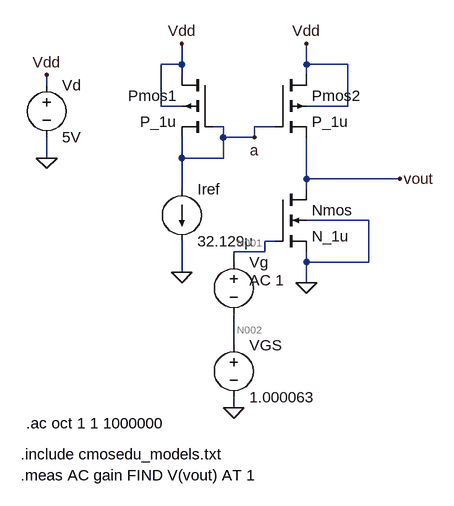
[diagram p0: schematic ex5.asc]
ex5.asc, the LTspice schematic file:
Version 4
SHEET 1 880 680
WIRE -1968 -1008 -1968 -1040
WIRE -1968 -1008 -2000 -1008
WIRE -1776 -1008 -1776 -1040
WIRE -1712 -1008 -1776 -1008
WIRE -1968 -992 -1968 -1008
WIRE -1776 -992 -1776 -1008
WIRE -2176 -976 -2176 -992
WIRE -2000 -944 -2000 -1008
WIRE -1968 -944 -2000 -944
WIRE -1712 -944 -1712 -1008
WIRE -1712 -944 -1776 -944
WIRE -1904 -912 -1920 -912
WIRE -1824 -912 -1856 -912
WIRE -1904 -896 -1904 -912
WIRE -1856 -896 -1856 -912
WIRE -1856 -896 -1904 -896
WIRE -2176 -864 -2176 -896
WIRE -1968 -864 -1968 -896
WIRE -1904 -864 -1904 -896
WIRE -1904 -864 -1968 -864
WIRE -1776 -832 -1776 -896
WIRE -1632 -832 -1776 -832
WIRE -1968 -816 -1968 -864
WIRE -1776 -816 -1776 -832
WIRE -1680 -768 -1776 -768
WIRE -1824 -736 -1840 -736
WIRE -1840 -720 -1840 -736
WIRE -1840 -720 -1888 -720
WIRE -1888 -704 -1888 -720
WIRE -1776 -704 -1776 -720
WIRE -1680 -704 -1680 -768
WIRE -1680 -704 -1776 -704
WIRE -1968 -688 -1968 -736
WIRE -1776 -672 -1776 -704
WIRE -1888 -576 -1888 -624
WIRE -1888 -480 -1888 -496
FLAG -2176 -864 0
FLAG -2176 -992 Vdd
FLAG -1968 -1040 Vdd
FLAG -1776 -1040 Vdd
FLAG -1968 -688 0
FLAG -1776 -672 0
FLAG -1632 -832 vout
FLAG -1888 -480 0
FLAG -1856 -896 a
SYMBOL voltage -2176 -992 R0
SYMATTR InstName Vd
SYMATTR Value 5V
SYMBOL pmos4 -1920 -992 M0
SYMATTR InstName Pmos1
SYMATTR Value P_1u
SYMATTR Value2 l=19.99564u w=3.00000u
SYMBOL pmos4 -1824 -992 R0
SYMATTR InstName Pmos2
SYMATTR Value P_1u
SYMATTR Value2 l=19.995640u w=3u
SYMBOL current -1968 -816 R0
WINDOW 123 0 0 Left 2
WINDOW 39 0 0 Left 2
SYMATTR InstName Iref
SYMATTR Value 32.129µ
SYMBOL nmos4 -1824 -816 R0
SYMATTR InstName Nmos
SYMATTR Value N_1u
SYMATTR Value2 l=1.500000u w=17.501335u
SYMBOL voltage -1888 -592 R0
WINDOW 123 0 0 Left 2
WINDOW 39 0 0 Left 2
SYMATTR InstName VGS
SYMATTR Value 1.000063
SYMBOL voltage -1888 -720 R0
WINDOW 123 24 44 Left 2
WINDOW 39 0 0 Left 2
SYMATTR Value2 AC 1
SYMATTR InstName Vg
SYMATTR Value ""
TEXT -2208 -456 Left 2 !.ac oct 1 1 1000000
TEXT -2216 -408 Left 2 !.include cmosedu_models.txt
TEXT -2216 -376 Left 2 !.meas AC gain FIND V(vout) AT 1

The netlist it stands for:
* ex5.asc
Vd Vdd 0 5V
M§Pmos1 Vdd a a Vdd P_1u l=19.99564u w=3.00000u
M§Pmos2 Vdd a vout Vdd P_1u l=19.995640u w=3u
Iref a 0 32.129µ
M§Nmos vout N001 0 0 N_1u l=1.500000u w=17.501335u
VGS N002 0 1.000063
Vg N001 N002 AC 1
.model NMOS NMOS
.model PMOS PMOS
.lib standard.mos
.ac oct 1 1 1000000
.include cmosedu_models.txt
.meas AC gain FIND V(vout) AT 1
.backanno
.end

* Results of the author's LTspice run, read from the files saved beside the schematic
* Operating Point, zero values left out:
*   V(vdd) = 5 V
*   V(a) = -272.3 mV
*   V(vout) = 1.419 V
*   V(n001) = 1 V
*   V(n002) = 1 V
*   Id(Nmos) = 32.08 µA
*   Ib(Nmos) = -1.429 pA
*   Is(Nmos) = -32.08 µA
*   Id(Pmos2) = 32.08 µA
*   Ib(Pmos2) = 3.591 pA
*   Is(Pmos2) = -32.08 µA
*   Id(Pmos1) = 32.13 µA
*   Ib(Pmos1) = 5.282 pA
*   Is(Pmos1) = -32.13 µA
*   I(Iref) = 32.13 µA
*   I(Vd) = -64.2 µA
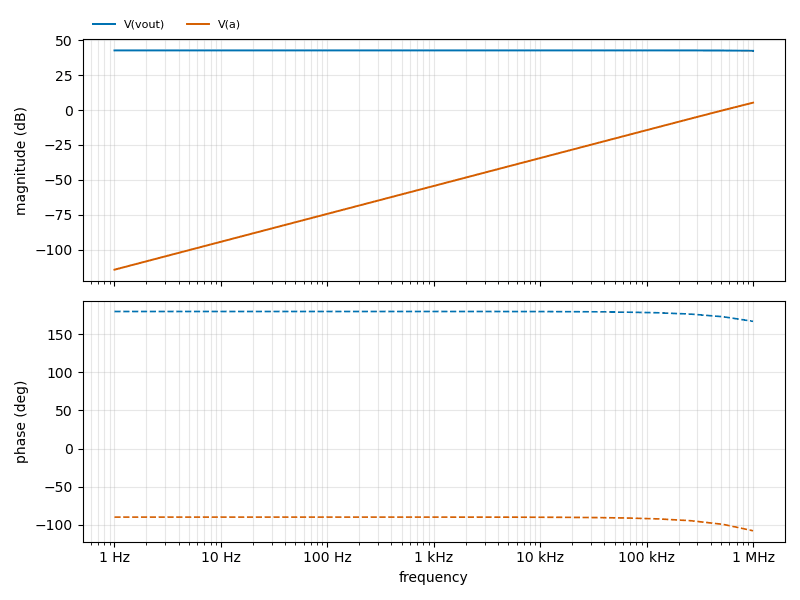
[diagram p1: AC Analysis of ex5.asc, plotted from the saved traces]
* AC Analysis, 1 run:
*   V(vout): 42.77 dB at 1 Hz, 42.47 dB at 1 MHz, peak 42.77 dB at 1 Hz
*   V(a): -114.37 dB at 1 Hz, 5.30 dB at 1 MHz, peak 5.30 dB at 1 MHz, 3 dB below the peak at 696.3 kHz